# EasyEDA schematic Controller.json
TITLE: Robot Controller; REV: 1.0; Date: 2024-03-17; Sheet: 1/1; Drawn By: Shane Wood Logan Martin
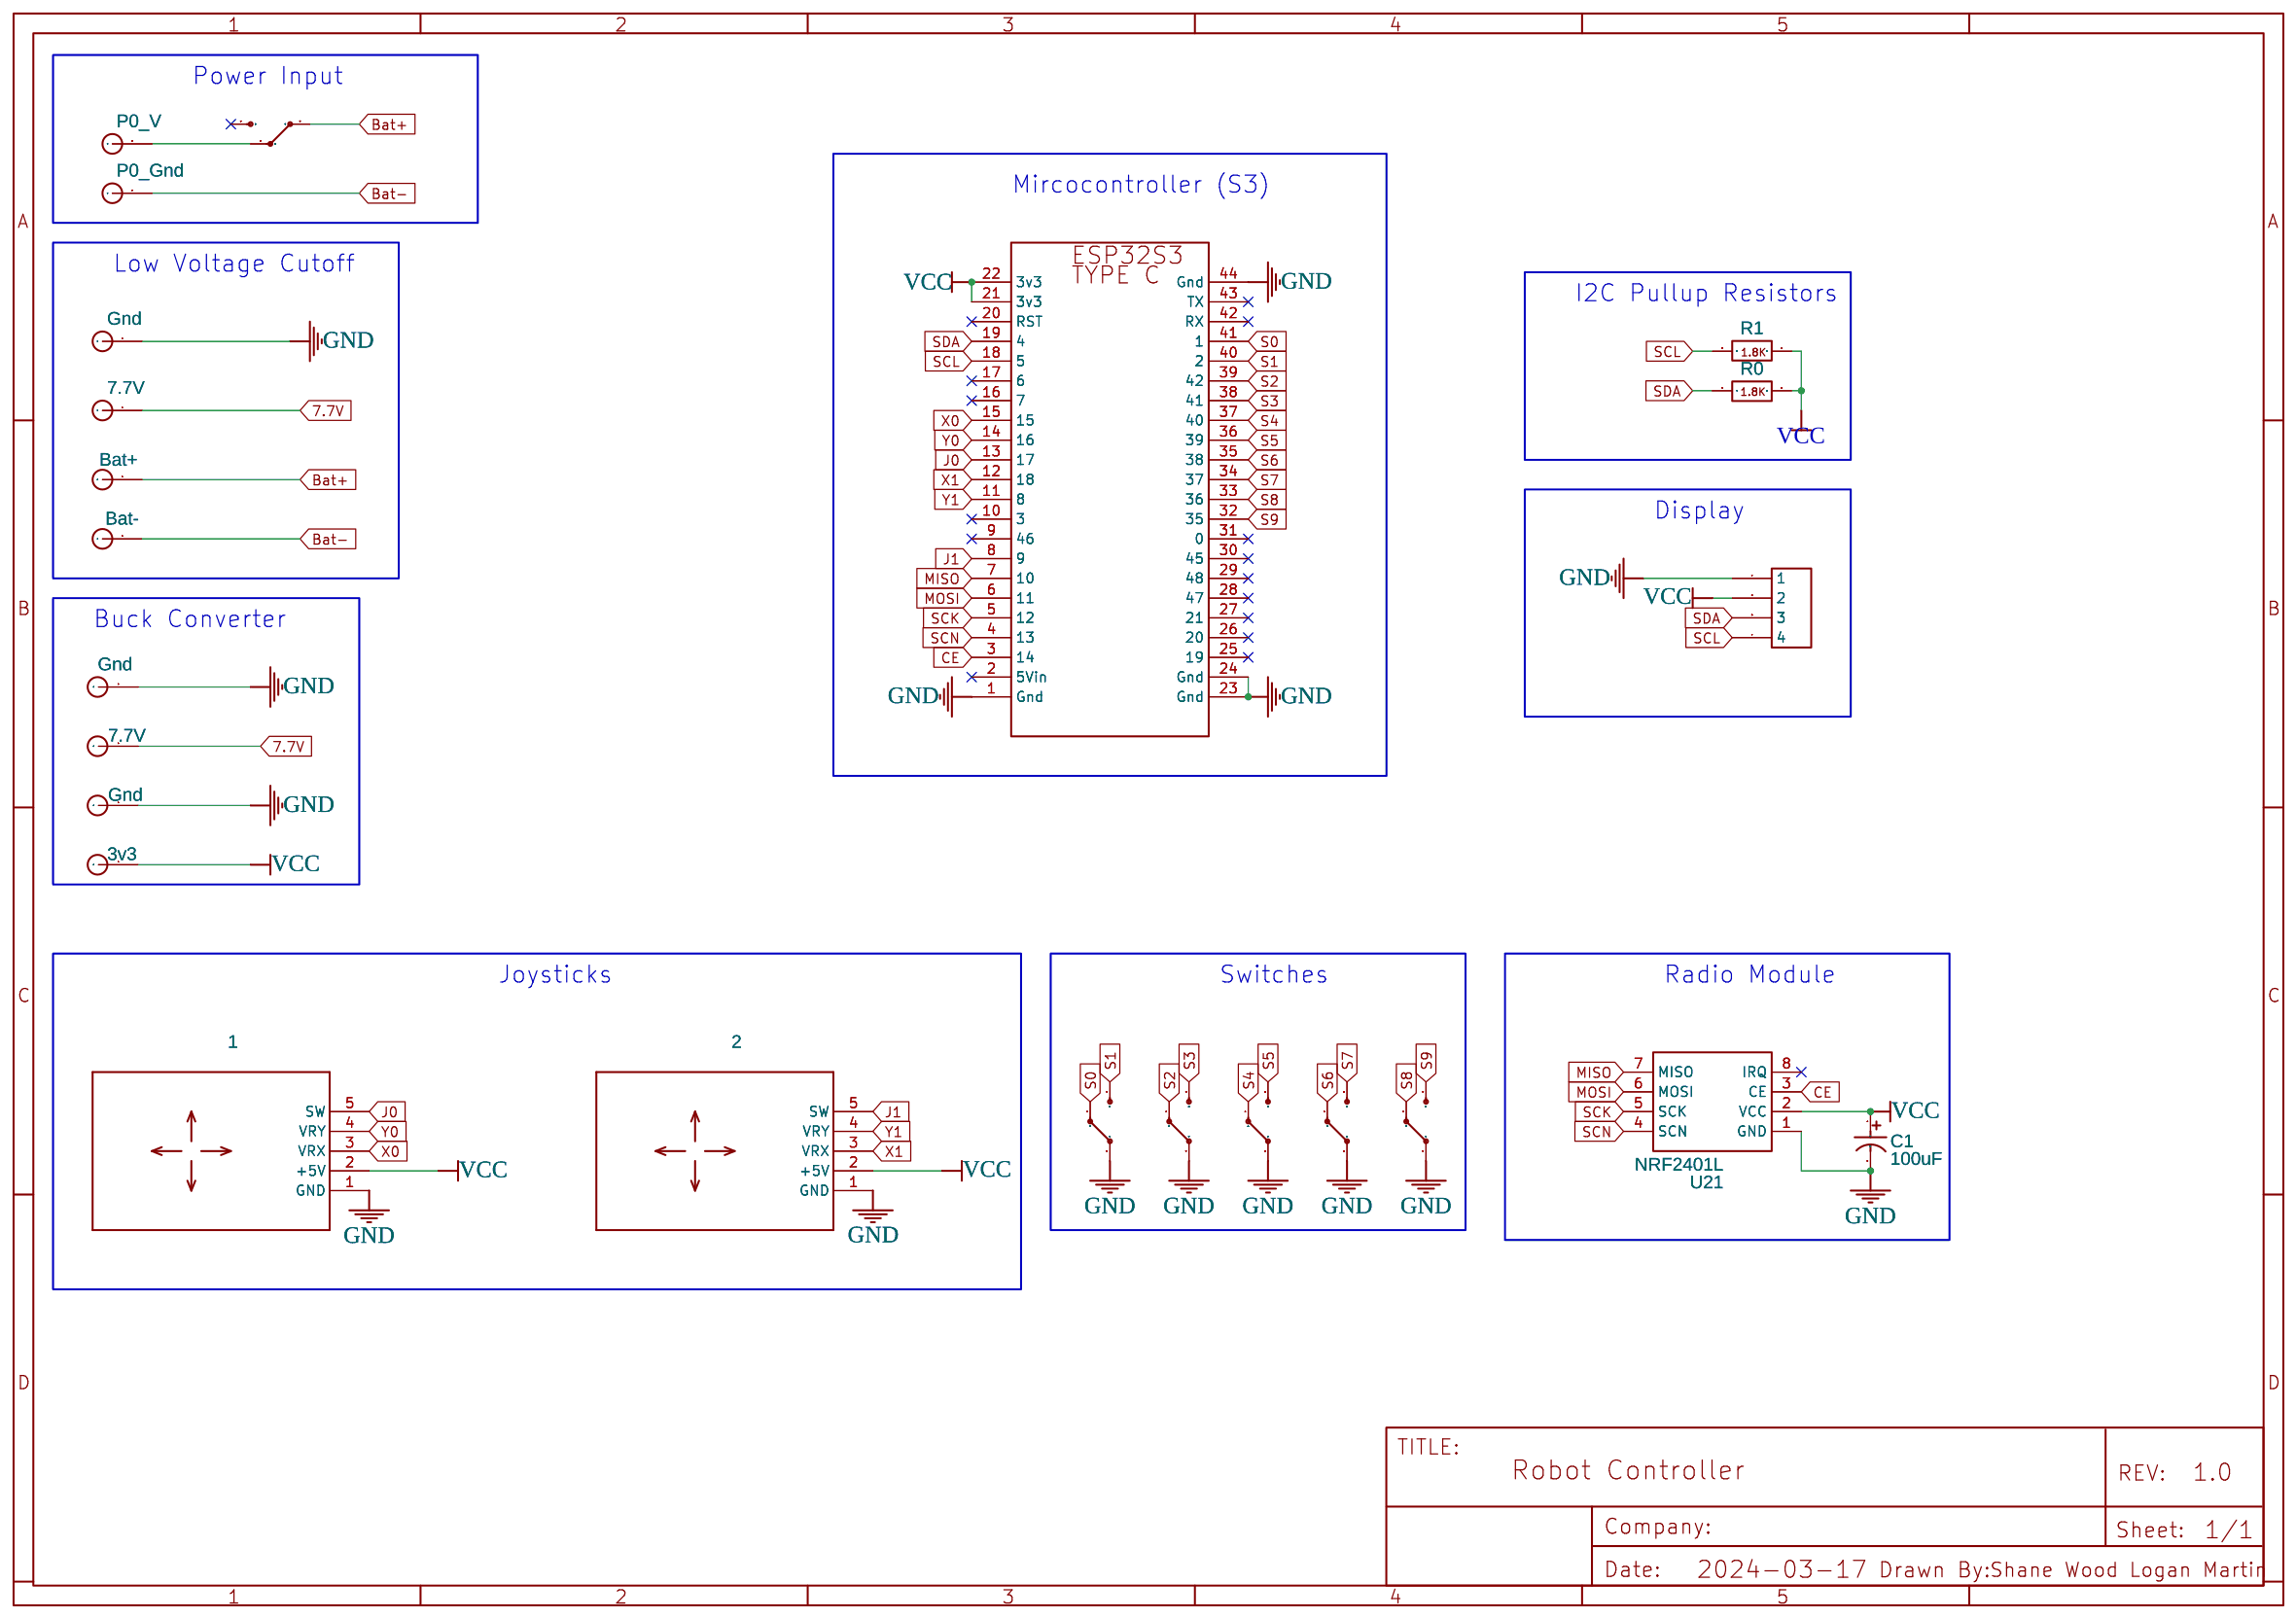
[diagram p0: schematic sheet]

## Parts
1  JOYSTICK-2AXIS-BUTTON  [JOYSTICK-2AXIS-BUTTON]
2  JOYSTICK-2AXIS-BUTTON  [JOYSTICK-2AXIS-BUTTON]
C1  100uF  [100UFX16V CAPACITOR D5.0XF11.0]
R1  R1  [1.8K RESISTOR 1/2W]
R2  R0  [1.8K RESISTOR 1/2W]
U1  NO  [TOGGLE SWITCH SPDT RED 3 PIN ON-OFF-ON 3 SPDT SMALL AC 6A/125V 3A/250V]
U2  P0_V  [14AWG PTH LARGE]
U3  P0_Gnd  [14AWG PTH LARGE]
U4  Bat+  [14AWG PTH LARGE]
U5  Gnd  [14AWG PTH LARGE]
U6  Bat-  [14AWG PTH LARGE]
U7  7.7V  [14AWG PTH LARGE]
U8  NO  [HDR-4X1/2.54]
U9  ESP32S3 TypeC  [ESP32S3 TYPEC]
U11  Gnd  [14AWG PTH LARGE]
U12  Gnd  [14AWG PTH LARGE]
U14  7.7V  [14AWG PTH LARGE]
U15  3v3  [14AWG PTH LARGE]
U16  NO  [TOGGLE SWITCH SPDT RED 3 PIN ON-OFF-ON 3 SPDT SMALL AC 6A/125V 3A/250V]
U17  NO  [TOGGLE SWITCH SPDT RED 3 PIN ON-OFF-ON 3 SPDT SMALL AC 6A/125V 3A/250V]
U18  NO  [TOGGLE SWITCH SPDT RED 3 PIN ON-OFF-ON 3 SPDT SMALL AC 6A/125V 3A/250V]
U19  NO  [TOGGLE SWITCH SPDT RED 3 PIN ON-OFF-ON 3 SPDT SMALL AC 6A/125V 3A/250V]
U20  NO  [TOGGLE SWITCH SPDT RED 3 PIN ON-OFF-ON 3 SPDT SMALL AC 6A/125V 3A/250V]
U21  NRF2401L  [NRF2401L]

## Library data of the parts
1 2 = JOYSTICK-2AXIS-BUTTON: Contributor: Krzysztof
C1 = CAP-POL-1: Supplier: My_collection; Manufacturer Part: Jweo; Rated Voltage: 16V; Contributor: stefanczykdk
R1 R2 = 1.8K_R_1/2W: Contributor: jokosays
U1 U16-U20 = TOGGLESWITCH SPST_SWITCH-SPDT COPY: sourceId: ceKgMGAuL; Contributor: hanzfortun09
U2-U7 U11 U12 U14 U15 = Wire Hole 14AWG: Manufacturer Part: Wire Hole; Contributor: dropTarget
U8 = Header-Female-2.54_1x4: Manufacturer: ReliaPro; Manufacturer Part: Female header pitch2.54mm; Contributor: akula26
U9 = ESP32S3 TypeC: Contributor: Guest
U21 = NRF2401L: Manufacturer Part: nrf2401l; Contributor: freddyka

## Nets
7.7V: U7.1 U14.1
GND: 1.1(GND) 2.1(GND) C1.2 U5.1 U8.1 U9.1(Gnd) U9.23(Gnd) U9.24(Gnd) U9.44(Gnd) U11.1 U12.1 U16.2(P) U17.2(P) U18.2(P) U19.2(P) U20.2(P) U21.1(GND)
VCC: 1.2(+5V) 2.2(+5V) C1.1 R1.1 R2.2 U8.2 U9.21(3v3) U9.22(3v3) U15.1 U21.2(VCC)
Bat+: U1.2(P) U4.1
Bat-: U3.1 U6.1
CE: U9.3(14) U21.3(CE)
J0: 1.5(SW) U9.13(17)
J1: 2.5(SW) U9.8(9)
MISO: U9.7(10) U21.7(MISO)
MOSI: U9.6(11) U21.6(MOSI)
S0: U9.41(1) U16.1(O)
S1: U9.40(2) U16.3(S)
S2: U9.39(42) U17.1(O)
S3: U9.38(41) U17.3(S)
S4: U9.37(40) U18.1(O)
S5: U9.36(39) U18.3(S)
S6: U9.35(38) U19.1(O)
S7: U9.34(37) U19.3(S)
S8: U9.33(36) U20.1(O)
S9: U9.32(35) U20.3(S)
SCK: U9.5(12) U21.5(SCK)
SCL: R1.2 U8.4 U9.18(5)
SCN: U9.4(13) U21.4(SCN)
SDA: R2.1 U8.3 U9.19(4)
X0: 1.3(VRX) U9.15
X1: 2.3(VRX) U9.12(18)
Y0: 1.4(VRY) U9.14(16)
Y1: 2.4(VRY) U9.11(8)
Net-(U1-1): U1.1(O) U2.1

Not connected (* = marked no-connect by the designer): U1 3(S)*; U9 2(5Vin)* 9(46)* 10(3)* 16(7)* 17(6)* 20(RST)* 25(19)* 26(20)* 27(21)* 28(47)* 29(48)* 30(45)* 31(0)* 42(RX)* 43(TX)*; U21 8(IRQ)*

## Notes on the sheet
- Power Input
- Mircocontroller (S3)
- Low Voltage Cutoff
- I2C Pullup Resistors
- Display
- Buck Converter
- Joysticks
- Switches
- Radio Module
